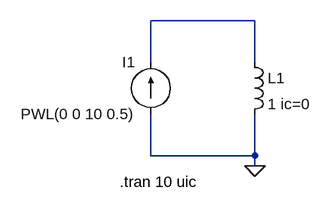
[diagram p0: schematic g4_p5.asc]
g4_p5.asc, the LTspice schematic file:
Version 4
SHEET 1 880 680
WIRE 240 64 80 64
WIRE 80 128 80 64
WIRE 240 128 240 64
WIRE 80 272 80 208
WIRE 240 272 240 208
WIRE 240 272 80 272
WIRE 240 288 240 272
FLAG 240 288 0
SYMBOL current 80 208 R180
WINDOW 0 24 80 Left 2
WINDOW 3 24 0 Left 2
WINDOW 123 0 0 Left 0
WINDOW 39 0 0 Left 0
SYMATTR InstName I1
SYMATTR Value PWL(0 0 10 0.5)
SYMBOL ind 224 112 R0
SYMATTR InstName L1
SYMATTR Value 1 ic=0
SYMATTR SpiceLine Rser=0
TEXT 32 312 Left 2 !.tran 10 uic

The netlist it stands for:
* g4_p5.asc
I1 0 N001 PWL(0 0 10 0.5)
L1 N001 0 1 ic=0 Rser=0
.tran 10 uic
.backanno
.end